# EAGLE design amplifier_v3 (EAGLE 6.5.0)
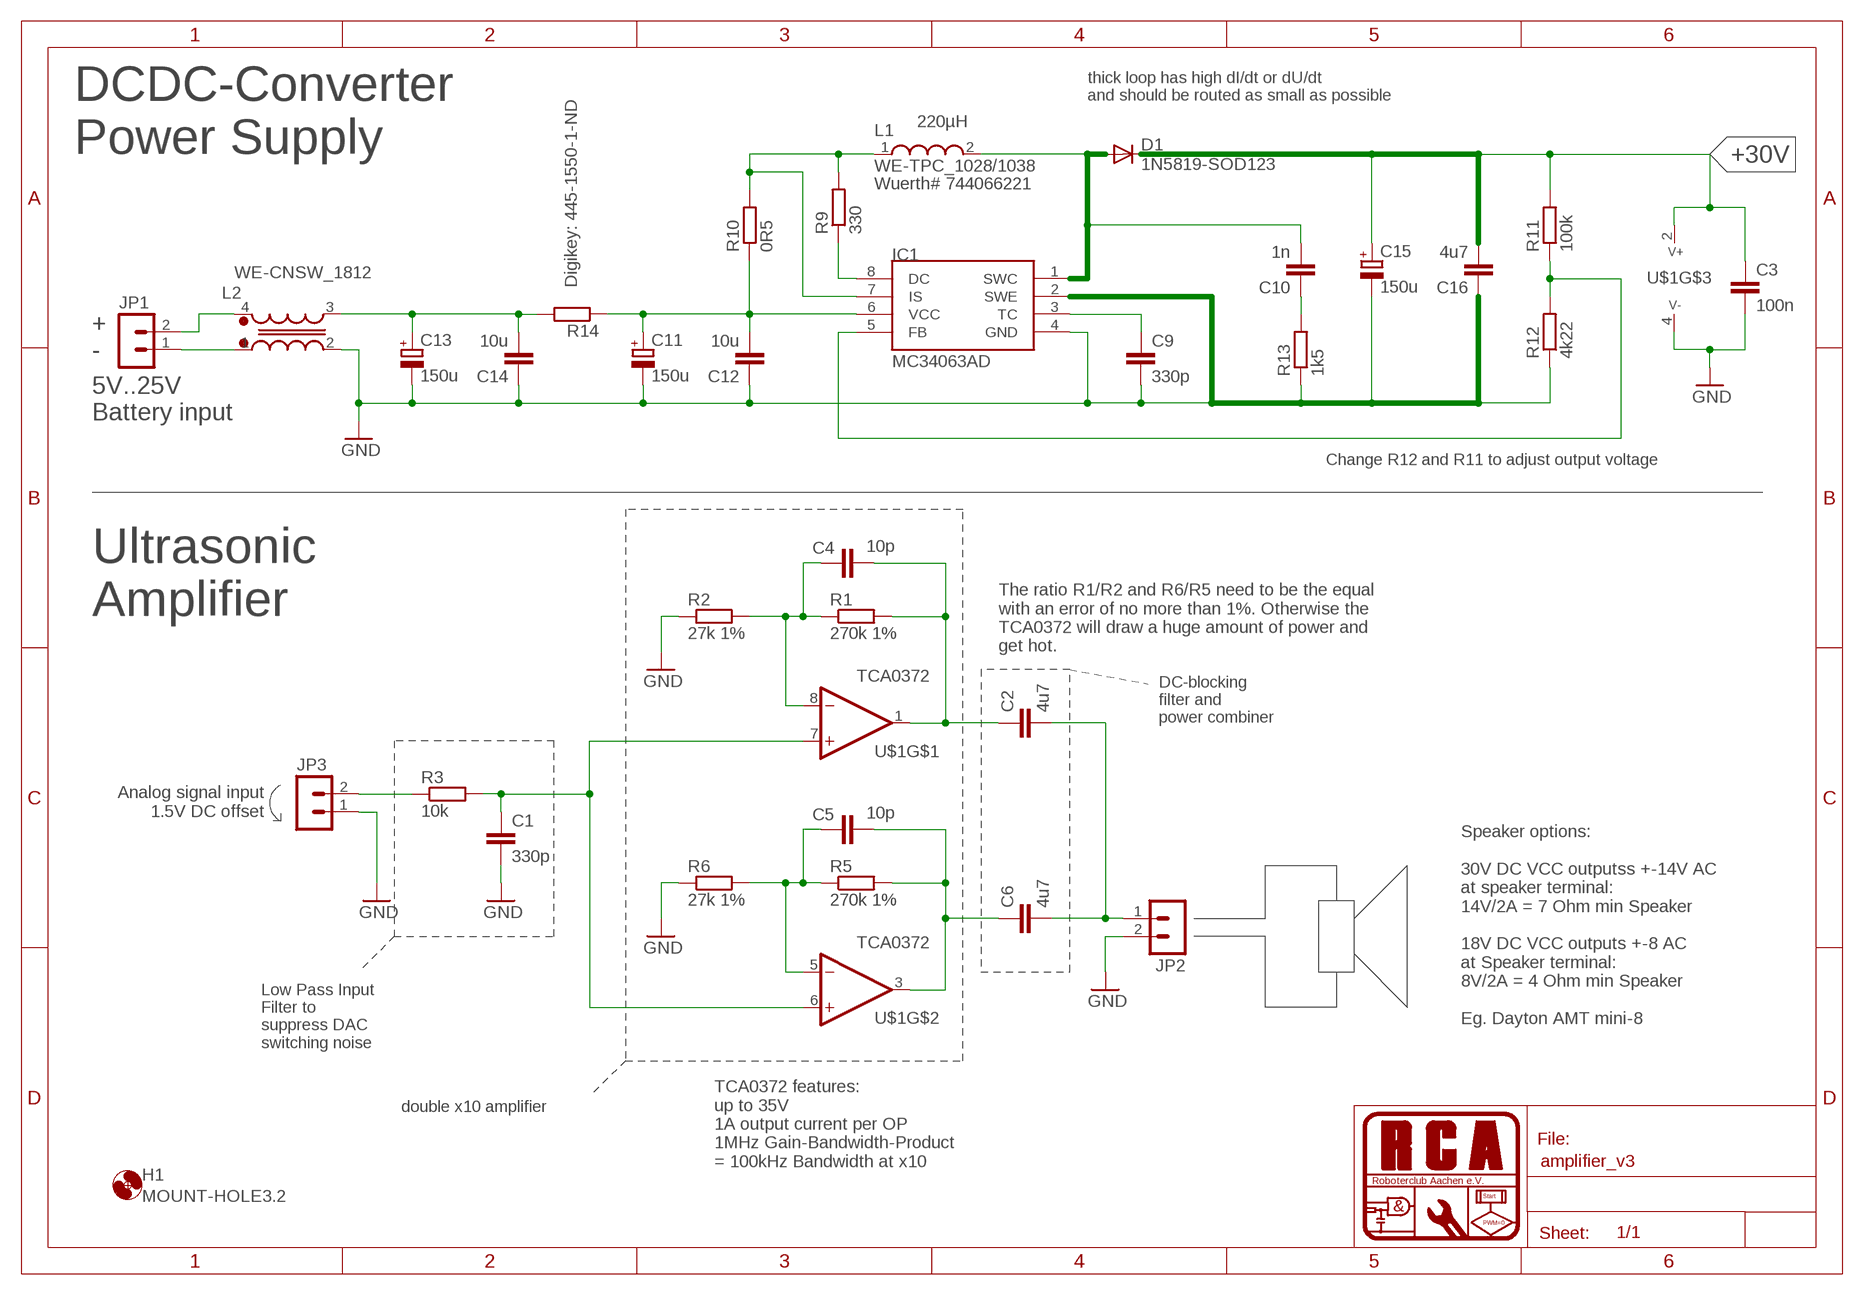
[diagram p0: schematic, sheet 1]

## Parts
C1  330p  C-EUC0603  [C0603]
C2  4u7  C-EUC0805  [C0805]
C3  100n  C-EUC0603  [C0603]
C4  10p  C-EUC0603  [C0603]
C5  10p  C-EUC0603  [C0603]
C6  4u7  C-EUC0805  [C0805]
C9  330p  C-EUC0603  [C0603]
C10  1n  C-EUC0603  [C0603]
C11  150u  CPOL-EUE3.5-8  [E3,5-8]
C12  10u  C-EUC0805  [C0805]
C13  150u  CPOL-EUE3.5-8  [E3,5-8]
C14  10u  C-EUC0805  [C0805]
C15  150u  CPOL-EUE3.5-8  [E3,5-8]
C16  4u7  C-EUC0805  [C0805]
D1  1N5819-SOD123  DIODE-SOD123  [SOD123]
H1  MOUNT-HOLE3.2  [3,2]
IC1  MC34063AD  [SOIC8]
JP1  PSS_2G  [22-23-2021]
JP2  PSS_2G  [22-23-2021]
JP3  PSS_2G  [22-23-2021]
L1  WE-TPC_1028/1038  [WE-TPC_1028/1038]
L2  WE-CNSW_1812  [WE-CNSW_1812]
R1  270k 1%  R-EU_R0603  [R0603]
R2  27k 1%  R-EU_R0603  [R0603]
R3  10k  R-EU_R0603  [R0603]
R5  270k 1%  R-EU_R0603  [R0603]
R6  27k 1%  R-EU_R0603  [R0603]
R9  330  R-EU_R0603  [R0603]
R10  0R5  R-EU_R0603  [R0603]
R11  100k  R-EU_R0603  [R0603]
R12  4k22  R-EU_R0603  [R0603]
R13  1k5  R-EU_R0603  [R0603]
R14  Digikey: 445-1550-1-ND  R-EU_R0603  [R0603]
U$1  TCA0372  [DIL08]

## Nets
+30V: C3.1 C15.+ C16.2 D1.C R11.2 U$1.2(V+)
GND: C1.2 C3.2 C9.2 C11.- C12.1 C13.- C14.1 C15.- C16.1 IC1.2(SWE) IC1.4(GND) JP2.2 JP3.1 L2.2 R2.1 R6.1 R12.1 R13.1 U$1.4(V-)
N$1: JP3.2 R3.1
N$2: C2.1 C4.2 R1.2 U$1.1(OUT)
N$3: C2.2 C6.2 JP2.1
N$4: C4.1 R1.1 R2.2 U$1.8(-IN)
N$5: C1.1 R3.2 U$1.6(+IN) U$1.7(+IN)
N$6: C5.2 C6.1 R5.2 U$1.3(OUT)
N$7: C5.1 R5.1 R6.2 U$1.5(-IN)
N$8: JP1.1 L2.1
N$10: JP1.2 L2.4
N$16: IC1.8(DC) R9.1
N$17: IC1.7(IS) L1.1 R9.2 R10.2
N$18: IC1.5(FB) R11.1 R12.2
N$20: C9.1 IC1.3(TC)
N$25: C10.1 R13.2
N$27: C11.+ C12.2 IC1.6(VCC) R10.1 R14.1
N$28: C13.+ C14.2 L2.3 R14.2
SWN: C10.2 D1.A IC1.1(SWC) L1.2

## Notes on the sheet
- thick loop has high dI/dt or dU/dt 
  and should be routed as small as possible
- 220µH
- DCDC-Converter
  Power Supply
- Wuerth# 744066221
- WE-CNSW_1812
- +
- -
- 5V..25V
  Battery input
- Change R12 and R11 to adjust output voltage
- Ultrasonic 
  Amplifier
- The ratio R1/R2 and R6/R5 need to be the equal
  with an error of no more than 1%. Otherwise the
  TCA0372 will draw a huge amount of power and
  get hot.
- DC-blocking
  filter and 
  power combiner
- Analog signal input
  1.5V DC offset
- Speaker options:
  
  30V DC VCC outputss +-14V AC 
  at speaker terminal: 
  14V/2A = 7 Ohm min Speaker
  
  18V DC VCC outputs +-8 AC 
  at Speaker terminal: 
  8V/2A = 4 Ohm min Speaker 
  
  Eg. Dayton AMT mini-8
- Low Pass Input
  Filter to 
  suppress DAC
  switching noise
- double x10 amplifier
- TCA0372 features:
  up to 35V
  1A output current per OP
  1MHz Gain-Bandwidth-Product
  = 100kHz Bandwidth at x10

## Library data of the parts
C1-C6 C9 C10 C12 C14 C16 = resistor:C-EU: CAPACITOR, European symbol
C11 C13 C15 = resistor:CPOL-EU: POLARIZED CAPACITOR, European symbol
D1 = diode:DIODE-: DIODE
H1 = holes:MOUNT-HOLE: MOUNTING HOLE with drill center marker
IC1 = mc34063:MC34063
JP1-JP3 = rca_stecker:PSS_2
L1 = Wurth_Elektronik_Passive_rev15b:WE-TPC: SMD Shielded Tiny Power Inductor Characteristics Extremely flat power inductor High current capability Magnetically shielded which results in a low leakage field Operating temperature: –40 °C to +125 °C Applications Portable power like PDA, digital camera, PCMCIA cards and displays DC/DC converter Embedded PC Mobile data gathering, telemetric <http://katalog.we-online.de/media/images/eisos/IndTPC_pf2.jpg> Details see: http://katalog.we-online.de/en/pbs/WE-TPC? Updated by Dan Xu 2014-07-11 2014 (C) Wurth Elektronik
L2 = Wurth_Elektronik_Passive_rev15b:WE-CNSW: WE-CNSW SMD Common Mode Line Filter Characteristics High common mode noise suppression at high frequencies Small influence on high speed signals through winding symmetry Operating temperature: –40 ºC to +125 ºC (Size 0805/1206/1812); –40 ºC to +105 ºC (Size 0603) Applications USB 2.0 IEEE 1394 (Firewire) LVDS High Speed Data Lines LAN <http://katalog.we-online.de/media/images/eisos/IndCNSW_pf2.jpg> Details see: http://katalog.we-online.de/en/pbs/WE-CNSW Updated by Dan Xu 2014-06-30 2014 (C) Wurth Elektronik
R1-R3 R5 R6 R9-R14 = resistor:R-EU_: RESISTOR, European symbol
U$1 = saw:TCA0372

## Board
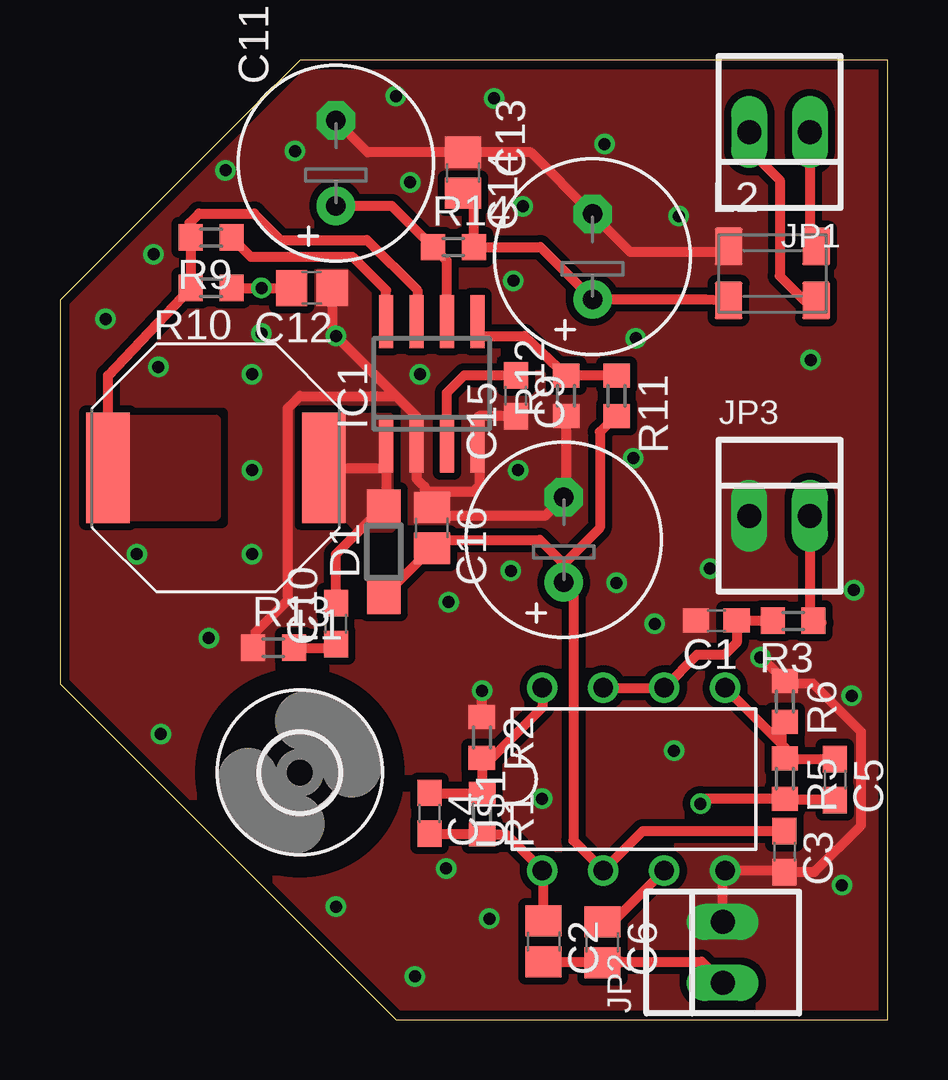
[diagram p1: board, top side]
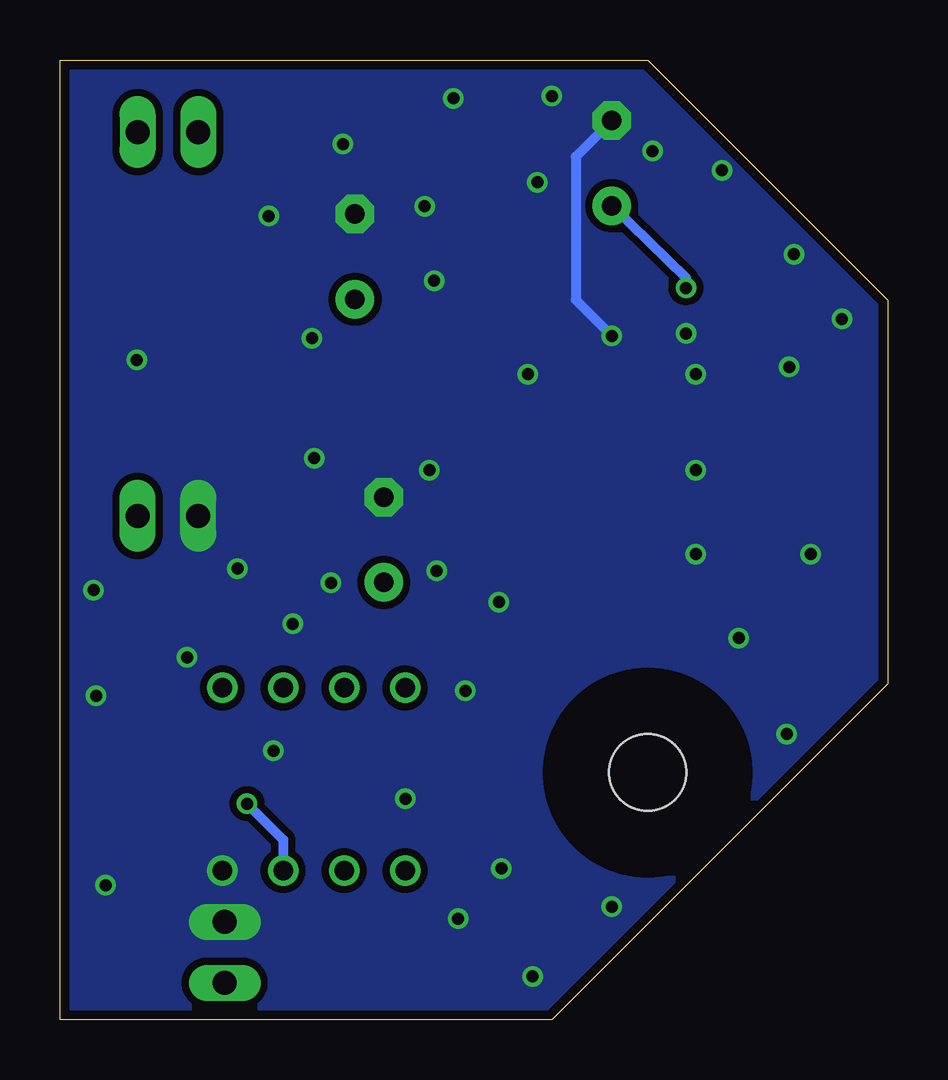
[diagram p2: board, bottom side, seen from below]

Size 34.5 x 40 mm. Coordinates in mm from the lower left corner, seen from the top.
Outline: 0,30 0,14 14,0 34.5,0 34.5,40 10,40 0,30
Copper layers (1*16): Top 0.0356mm / dielectric 1.5011mm / Bottom 0.0356mm
Design rules "oshPCBOrder *": minimum track width 6mil, minimum drill 13mil, track to track 6mil, track to pad 6mil, pad to pad 6mil, via to via 6mil, smd to smd 6mil, copper to edge 15mil, drill to drill 6mil, minimum pad ring 7mil, minimum via ring 7mil, stop-mask expansion 3mil, vias tented up to drill 99mil, thermal gap 10mil

### Footprints (pad centres in the part's own frame; a part is rotated, then mirrored left to right if it is on the bottom)
C0603 = smd 1.1 x 1: 1 -0.85,0; 2 0.85,0
C0805 = smd 1.3 x 1.5: 1 -0.85,0; 2 0.85,0
E3,5-8 = drill 0.813 pad 1.6: + -1.778,0 | drill 0.813 pad 1.6 octagon: - 1.778,0
SOD123 = smd 1.4 x 1.4: A 1.9,0; C -1.9,0
3,2 = hole 3.2: 0,0
SOIC8 = smd 0.6 x 2.2: 1 -1.905,-2.6; 2 -0.635,-2.6; 3 0.635,-2.6; 4 1.905,-2.6; 5 1.905,2.6; 6 0.635,2.6; 7 -0.635,2.6; 8 -1.905,2.6
22-23-2021 = drill 1 long: 1 -1.27,0; 2 1.27,0
WE-TPC_1028/1038 = smd 4.6 x 1.8: 1 0,4.5; 2 0,-4.5
WE-CNSW_1812 = smd 1.15 x 1.55: 1 -1.825,-1.125; 2 1.825,-1.125; 3 1.825,1.125; 4 -1.825,1.125
R0603 = smd 1 x 1.1: 1 -0.85,0; 2 0.85,0
DIL08 = drill 0.813 pad 1.27: 1 -3.81,-3.81; 2 -1.27,-3.81; 3 1.27,-3.81; 4 3.81,-3.81; 5 3.81,3.81; 6 1.27,3.81; 7 -1.27,3.81; 8 -3.81,3.81

### Placement (x,y rotation side)
C1  27.36,16.63 180 top
C2  20.16,3.26 270 top
C3  30.2,7 270 top
C4  15.4,8.6 270 top
C5  32.3,10 270 top
C6  22.61,3.22 270 top
C9  19,26 270 top
C10  11.5,16.5 90 top
C11  11.5,35.7 90 top
C12  10.5,30.5 180 top
C13  22.2,31.8 90 top
C14  16.8,35.3 270 top
C15  21,20 90 top
C16  15.5,20.5 270 top
D1  13.5,19.5 90 top
H1  10,10.3 0 top
IC1  15.5,26.5 0 top
JP1  30,37 180 top
JP2  27.63,2.8 90 top
JP3  30,21 0 top
L1  6.5,23 90 top
L2  29.7,31.1 180 top
R1  17.6,8.56 270 top
R2  17.59,11.76 270 top
R3  30.56,16.62 180 top
R5  30.22,10.04 270 top
R6  30.22,13.26 270 top
R9  6.3,32.6 180 top
R10  6.3,30.5 180 top
R11  23.2,26 270 top
R12  21.1,26 90 top
R13  8.9,15.5 0 top
R14  16.4,32.2 0 top
U$1  23.92,10.02 0 top

### Tracks (layer width: path | path; a pad name or v marks a point on that pad's centre or on a via)
+30V
  Top 0.406: D1.C 13.5,17.65 C16.2 15.85,20 20,20 21,19 | 21,19 C15.+ 21.4,17.82 21.4,7.46 U$1.2 24.29,7.85 C3.1 | R11.2 23,25 22.5,24.5 22.5,20.5 21,19
GND  (via drill 0.5)
  Top 0.406: C9.2 17.45,25.15 17.4,24.7 IC1.4 17.5,23.8 17.5,22.3 17.2,22 15.2,22 | 15.2,22 15.2,22.2 14.87,22.54 IC1.2 14.87,25.14 14,26 | 15.2,22 15.2,21.65 C16.1 15.65,21.35 16,21 20.22,21 C15.- 21.1,21.88 R12.1 | C12.1 11.35,28.65 v11.5,28.5 14,26 | 14,26 10,26 9.5,25.5 9.5,17.5 8.15,16.15 8.15,15.6 R13.1 | C11.- 12.83,36.15 C14.1 19.63,36.15 C13.- 23.78,32 27.5,32 | JP2.2 27.63,6.11 U$1.4 30.14,6.21 C3.2 31.45,6.15 33.4,8.1 33.4,12 31.4,14 30.33,14 R6.1 | 30.59,14.11 R6.1 | R2.1 v17.6,13.7 | R6.1 29.6,14.73 v29.2,15.1
  Bottom 0.406: C11.- 13,35.98 13,30 v11.5,28.5
  other vias: 17.9,4.2 16.1,6.3 16.2,17.4 6.2,15.9 3.2,19.4 20.1,9.2 25.6,11.2 24.8,16.5 23.2,18.2 23.9,23.4 18.8,18.7 19.1,22.9 15,26.9 8,19.4 4.1,27.2 8.4,28.6 1.9,29.2 3.9,31.9 6.9,35.4 9.8,36.2 14,38.5 18.1,38.4 22.7,36.5 25.8,33.5 19.3,33.9 14.6,34.9 18.9,30.8 24,28.4 31.3,27.5 27.1,18.8 33.1,17.9 8,26.9 8,22.9 4.2,11.9 11.5,4.7 14.8,1.8 32.6,5.6 33,13.5
  pour Top (isolate 0.3, rank 2, no thermals): -1,-1.5 -1,41.5 36.5,41.5 36.5,-1.5
  pour Bottom (isolate 0.3, rank 2, no thermals): -0.5,-2.5 -0.5,40.5 37,40.5 37,-2.5
N$1
  Top 0.406: 31.74,16.55 R3.1 31.27,16.36 JP3.2
N$2
  Top 0.406: C2.1 20.16,6.16 U$1.1 18.61,7.71 R1.2 15.44,7.71 C4.2
N$3
  Top 0.406: C2.2 23.4,2.41 | 23.4,2.41 26.75,2.41 JP2.1 | C6.2 23.36,2.37 23.4,2.41
N$4
  Top 0.406: U$1.8 20.11,13.01 17.65,10.55 | 17.65,10.55 17.6,10.5 R1.1 15.44,9.41 C4.1 | R2.2 17.65,10.85 17.65,10.55
N$5
  Top 0.406: U$1.7 U$1.6 26.56,15.2 27.7,15.2 28.21,15.71 C1.1 R3.2
N$6  (via drill 0.5)
  Top 0.406: C6.1 23.05,4.07 U$1.3 | v26.7,9 26.89,9.19 R5.2 30.26,9.15 C5.2
  Bottom 0.406: v26.7,9 25.19,7.49 U$1.3
N$7
  Top 0.406: U$1.5 30.08,11.48 | 30.08,11.48 30.22,11.34 R5.1 30.26,10.85 C5.1 | R6.2 30.08,12.27 30.08,11.48
N$8
  Top 0.406: JP1.1 31.27,32.48 L2.1
N$10
  Top 0.406: JP1.2 28.73,36.27 30,35 30,31 31,30 31.5,30 L2.4
N$16
  Top 0.406: IC1.8 13.6,30.4 12.2,31.8 7.95,31.8 R9.1
N$17
  Top 0.406: L1.1 2,26.85 R10.2 R9.2 5.4,32.65 5.4,33.2 5.8,33.6 8.1,33.6 9.2,32.5 12.8,32.5 14.9,30.4 14.9,29.14 IC1.7
  pour Top (no thermals): 2,21 6.5,21 6.5,25 2,25
N$18
  Top 0.406: R11.1 R12.2 19.35,28.5 17.5,28.5 17.41,28.59 IC1.5
N$20
  Top 0.406: C9.1 16.85,26.85 16.13,26.14 IC1.3
N$25
  Top 0.406: R13.2 11.35,15.5 C10.1
N$27  (via drill 0.5)
  Top 0.406: R10.1 v8.4,30.5 C12.2 | IC1.6 16.13,31.61 R14.1 13.83,33.92 C11.+
  Bottom 0.406: C11.+ 8.4,30.92 v8.4,30.5
N$28
  Top 0.406: C14.2 17.25,34 R14.2 20.02,32.2 C13.+ 26.92,30.02 L2.3
SWN
  Top 0.406: D1.A 13.45,20.9 | IC1.1 13.6,23 | 13.6,23 13.6,21 D1.A | L1.2 13.6,23 | C10.2 11.5,19.4 D1.A
  pour Top (no thermals): 10.3,25.1 13.7,25.1 13.7,21.3 13.8,21.3 13.8,20.5 12.4,20.5 12,20.9 10.3,20.9

### Text on the board
tSilkscreen: + | - | Power / Supply | signal | - | speaker